# EAGLE schematic vbus_v2 (EAGLE 6.3)
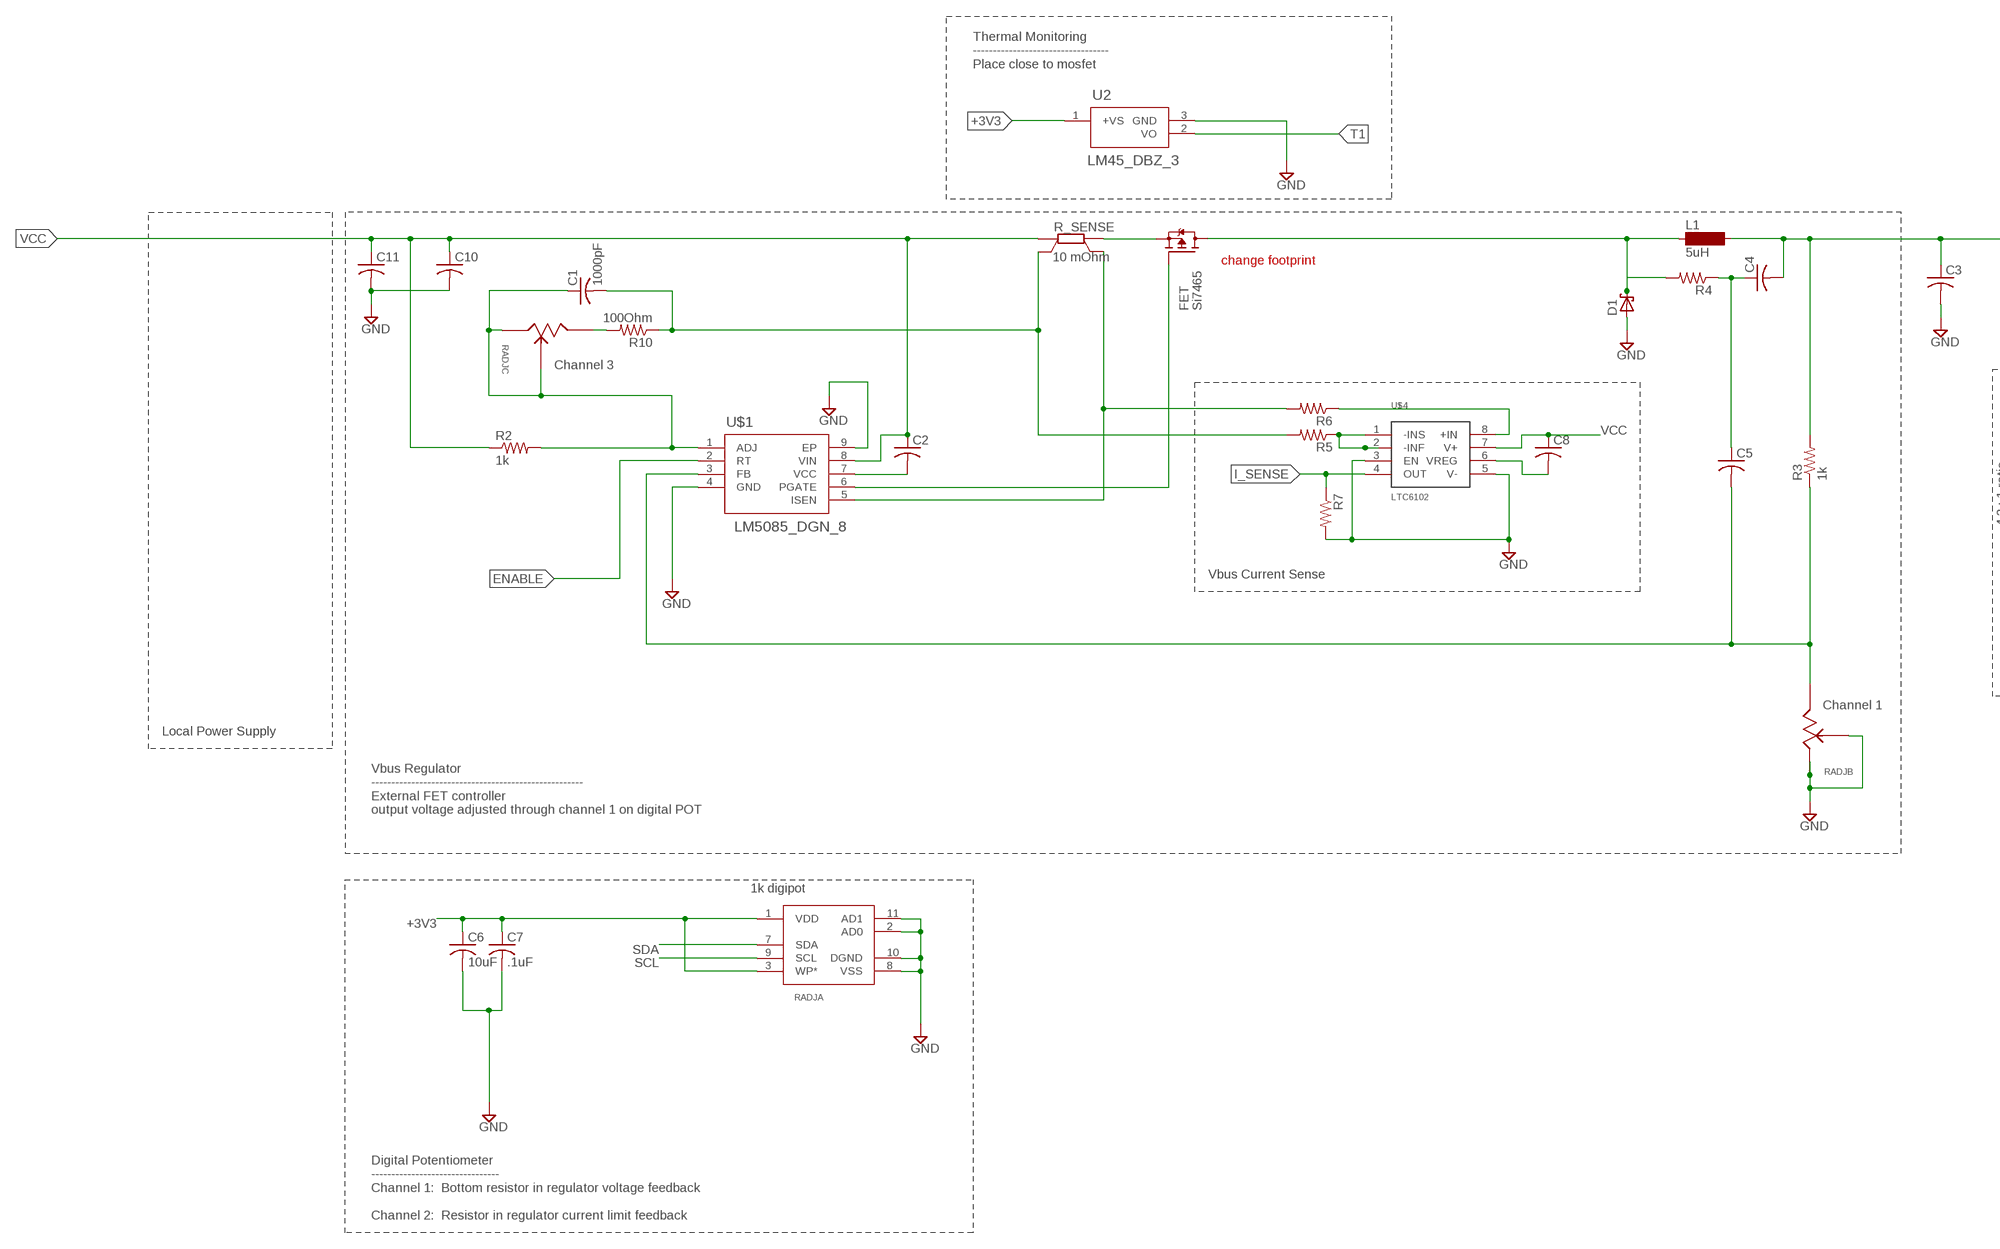
[diagram p0: schematic, sheet 1, part 1 of 2]
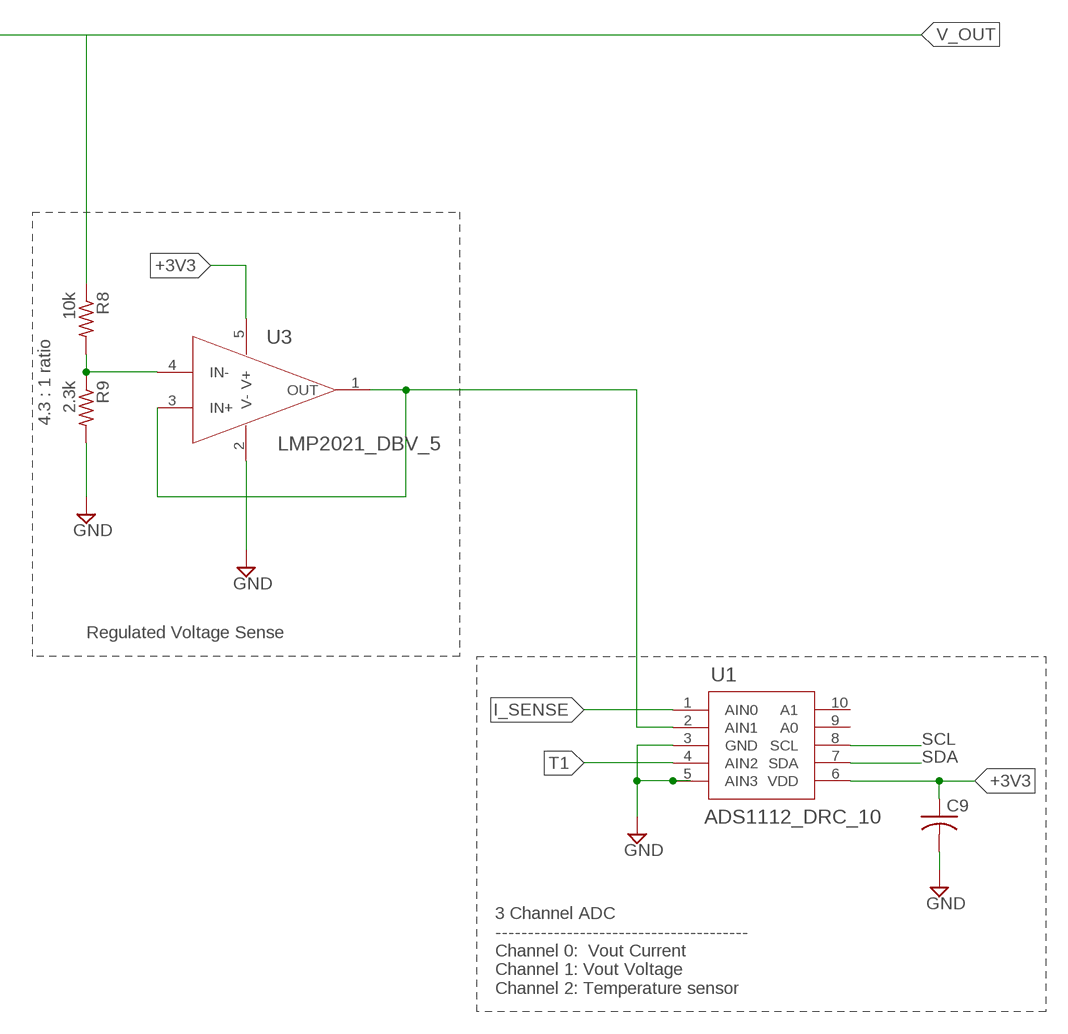
[diagram p1: schematic, sheet 1, part 2 of 2]

## Parts
C1  1000pF  C-USC0805  [C0805]
C2  C-USC0805  [C0805]
C3  C-USC0805  [C0805]
C4  C-USC0805  [C0805]
C5  C-USC0805  [C0805]
C6  10uF  C-USC0805  [C0805]
C7  .1uF  C-USC0805  [C0805]
C8  C-USC0805  [C0805]
C9  C-USC0805  [C0805]
C10  C-USC0805  [C0805]
C11  C-USC0805  [C0805]
D1  SCHOTTKY-DIODETO92H  [TO92H]
FET  Si7465  FDT434P  [SOT-223]
L1  5uH  MS50  [MS50]
R2  1k  R-US_M0805  [M0805]
R3  1k  R-US_M0805  [M0805]
R4  R-US_M0805  [M0805]
R5  R-US_M0805  [M0805]
R6  R-US_M0805  [M0805]
R7  R-US_M0805  [M0805]
R8  10k  R-US_M0805  [M0805]
R9  2.3k  R-US_M0805  [M0805]
R10  100Ohm  R-US_M0805  [M0805]
R_SENSE  10 mOhm  SMV  [SMV]
RADJ  AD5252  [RU_14]
U1  ADS1112_DRC_10  [DG6-10]
U2  LM45_DBZ_3  [MF03A]
U3  LMP2021_DBV_5  [MF05A]
U$1  LM5085_DGN_8  [MUY08A]
U$4  LTC6102  [MS8]

## Nets
+3V3: C6.1 C7.1 C9.1 RADJ.1(A:VDD) RADJ.3(A:WP*) U1.6(VDD) U2.1(+VS) U3.5(V+)
ENABLE: U$1.2(RT)
FB: C5.2 R3.1 RADJ.6(B:A1) U$1.3(FB)
GND: C3.2 C6.2 C7.2 C9.2 C10.2 C11.2 D1.1(A) R7.2 R9.2 RADJ.2(A:AD0) RADJ.4(B:W1) RADJ.5(B:B1) RADJ.8(A:VSS) RADJ.10(A:DGND) RADJ.11(A:AD1) U1.3(GND) U1.5(AIN3) U2.3(GND) U3.2(V-) U$1.4(GND) U$1.9(EP) U$4.3(EN) U$4.5(V-)
I_SENSE: R7.1 U1.1(AIN0) U$4.4(OUT)
N$1: FET.3(S) R_SENSE.I1(A)
N$2: FET.1(G) U$1.6(PGATE)
N$4: R5.1 U$4.1(-INS) U$4.2(-INF)
N$5: R6.1 U$4.8(+IN)
N$6: C2.2 U$1.7(VCC)
N$8: C8.2 U$4.6(VREG)
N$10: D1.2(C) FET.2(D) FET.4(D) L1.1 R4.2
N$11: R10.2 RADJ.12(C:A1)
N$12: C4.1 C5.1 R4.1
N$14: U1.2(AIN1) U3.1(OUT) U3.3(IN+)
R_SENSE: C1.1 R2.2 RADJ.13(C:B1) RADJ.14(C:W1) U$1.1(ADJ)
SCL: RADJ.9(A:SCL) U1.8(SCL)
SDA: RADJ.7(A:SDA) U1.7(SDA)
T1: U1.4(AIN2) U2.2(VO)
V_OUT: C3.1 C4.2 L1.2 R3.2 R8.1
V_SENSE: R8.2 R9.1 U3.4(IN-)
VCC: C2.1 C8.1 C10.1 C11.1 R2.1 R_SENSE.I2(B) U$1.8(VIN) U$4.7(V+)
VCC1: R6.2 R_SENSE.U1(SA) U$1.5(ISEN)
VCC_SENSE: C1.2 R5.2 R10.1 R_SENSE.U2(SB)
Unconnected: U1.9(A0) U1.10(A1)

## Notes on the sheet
- Thermal Monitoring
  ----------------------------------
  Place close to mosfet
- change footprint
- Channel 3
- 4.3 : 1 ratio
- Vbus Current Sense
- Regulated Voltage Sense
- Channel 1
- Local Power Supply
- Vbus Regulator
  -----------------------------------------------------
  External FET controller
  output voltage adjusted through channel 1 on digital POT
- 1k digipot
- 3 Channel ADC
  ---------------------------------------
  Channel 0:  Vout Current
  Channel 1: Vout Voltage
  Channel 2: Temperature sensor
- Digital Potentiometer
  --------------------------------
  Channel 1:  Bottom resistor in regulator voltage feedback
  
  Channel 2:  Resistor in regulator current limit feedback

## Library data of the parts
C1-C11 = adafruit:C-US: CAPACITOR, American symbol
D1 = adafruit:SCHOTTKY-DIODE: Schottky Diode
FET = TexasInstruments:FDT434P
L1 = inductor-neosid:MS50: INDUCTOR SMD power inductor; OC_FARNELL: unknown; OC_NEWARK: unknown
R2-R10 = adafruit:R-US_: RESISTOR, American symbol
R_SENSE = resistor-shunt:SMV: SMD SHUNT RESISTOR; OC_FARNELL: unknown; OC_NEWARK: unknown
RADJ = linear:AD5252
U1 = TexasInstruments:ADS1112_DRC_10
U2 = TexasInstruments:LM45_DBZ_3; BASE_PN: LM45; COMPTYPE: TempSensors; PARTNUMBER: LM45BIM3; SYMBOL: NameLM45BIM3; TYPE: LM45BIM3; VENDOR: NationalSemiconductor; VERSION: 05/02/2007
U3 = TexasInstruments:LMP2021_DBV_5
U$1 = TexasInstruments:LM5085_DGN_8; MANUFACTURER_PART_NUMBER: lm5085mynopb; VENDOR: National
U$4 = linear:LTC6102